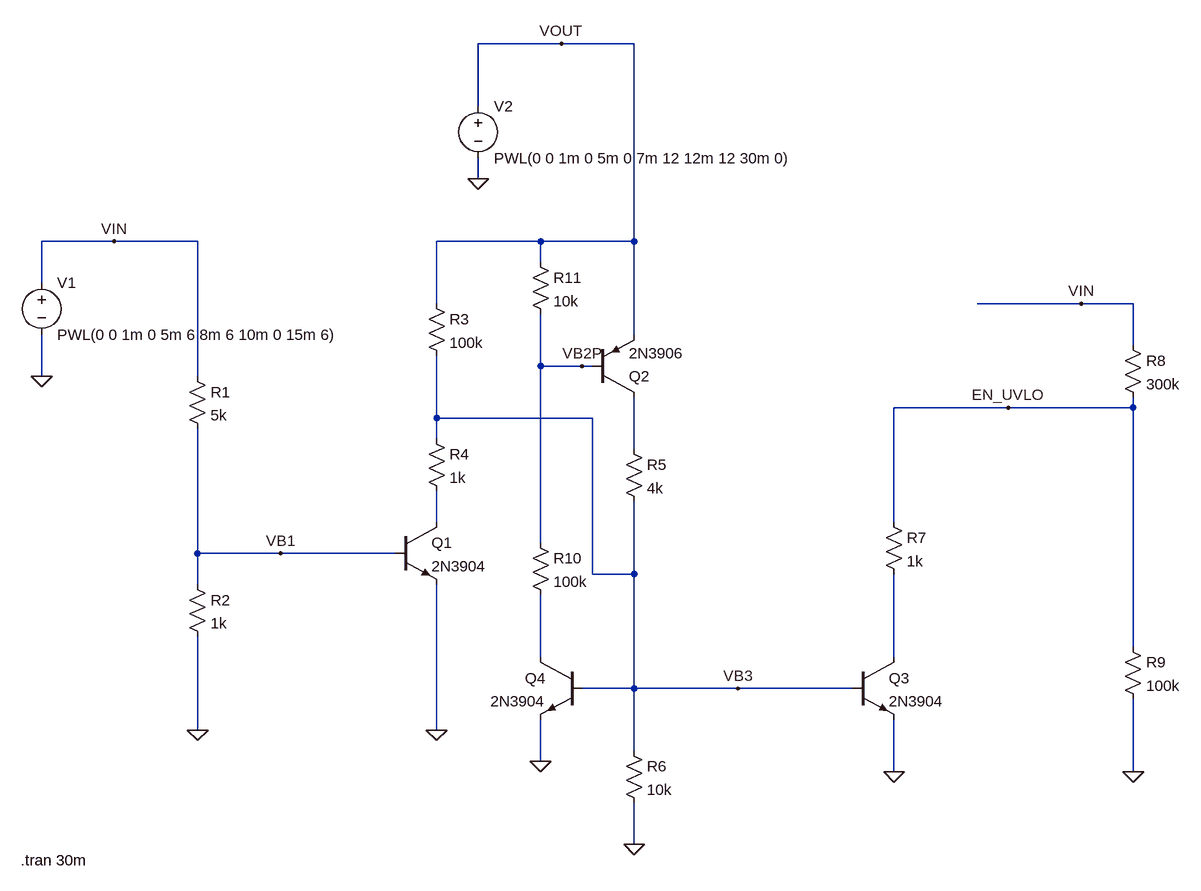
[diagram p0: schematic en_uvlo_lockout_old.asc]
en_uvlo_lockout_old.asc, the LTspice schematic file:
Version 4
SHEET 1 1280 680
WIRE 320 -720 192 -720
WIRE 432 -720 320 -720
WIRE 192 -624 192 -720
WIRE 192 -512 192 -544
WIRE -368 -416 -480 -416
WIRE -240 -416 -368 -416
WIRE 288 -416 128 -416
WIRE 432 -416 432 -720
WIRE 432 -416 288 -416
WIRE 288 -384 288 -416
WIRE -480 -352 -480 -416
WIRE 128 -320 128 -416
WIRE 1120 -320 960 -320
WIRE 1200 -320 1120 -320
WIRE 432 -272 432 -416
WIRE 1200 -256 1200 -320
WIRE 288 -224 288 -304
WIRE 352 -224 288 -224
WIRE 368 -224 352 -224
WIRE -480 -208 -480 -272
WIRE -240 -208 -240 -416
WIRE 1008 -160 832 -160
WIRE 1200 -160 1200 -176
WIRE 1200 -160 1008 -160
WIRE 128 -144 128 -240
WIRE 368 -144 128 -144
WIRE 128 -112 128 -144
WIRE 432 -96 432 -176
WIRE 128 16 128 -32
WIRE 832 16 832 -160
WIRE 288 48 288 -224
WIRE -240 64 -240 -128
WIRE -112 64 -240 64
WIRE 64 64 -112 64
WIRE 368 96 368 -144
WIRE 432 96 432 -16
WIRE 432 96 368 96
WIRE -240 112 -240 64
WIRE 1200 208 1200 -160
WIRE 288 224 288 128
WIRE 832 224 832 96
WIRE 432 272 432 96
WIRE 432 272 352 272
WIRE 592 272 432 272
WIRE 768 272 592 272
WIRE -240 336 -240 192
WIRE 128 336 128 112
WIRE 432 368 432 272
WIRE 288 384 288 320
WIRE 832 400 832 320
WIRE 1200 400 1200 288
WIRE 432 512 432 448
FLAG -240 336 0
FLAG 128 336 0
FLAG 432 512 0
FLAG 288 384 0
FLAG 832 400 0
FLAG 1200 400 0
FLAG -480 -208 0
FLAG 192 -512 0
FLAG -368 -416 VIN
FLAG 1120 -320 VIN
FLAG 1008 -160 EN_UVLO
FLAG -112 64 VB1
FLAG 592 272 VB3
FLAG 352 -224 VB2P
FLAG 320 -720 VOUT
SYMBOL npn 64 16 R0
SYMATTR InstName Q1
SYMATTR Value 2N3904
SYMBOL pnp 368 -176 M180
SYMATTR InstName Q2
SYMATTR Value 2N3906
SYMBOL npn 768 224 R0
SYMATTR InstName Q3
SYMATTR Value 2N3904
SYMBOL res -256 -224 R0
SYMATTR InstName R1
SYMATTR Value 5k
SYMBOL res -256 96 R0
SYMATTR InstName R2
SYMATTR Value 1k
SYMBOL res 112 -336 R0
SYMATTR InstName R3
SYMATTR Value 100k
SYMBOL res 112 -128 R0
SYMATTR InstName R4
SYMATTR Value 1k
SYMBOL res 416 -112 R0
SYMATTR InstName R5
SYMATTR Value 4k
SYMBOL res 416 352 R0
SYMATTR InstName R6
SYMATTR Value 10k
SYMBOL res 816 0 R0
SYMATTR InstName R7
SYMATTR Value 1k
SYMBOL res 1184 -272 R0
SYMATTR InstName R8
SYMATTR Value 300k
SYMBOL res 1184 192 R0
SYMATTR InstName R9
SYMATTR Value 100k
SYMBOL npn 352 224 M0
SYMATTR InstName Q4
SYMATTR Value 2N3904
SYMBOL res 272 32 R0
SYMATTR InstName R10
SYMATTR Value 100k
SYMBOL voltage -480 -368 R0
WINDOW 123 0 0 Left 0
WINDOW 39 0 0 Left 0
SYMATTR InstName V1
SYMATTR Value PWL(0 0 1m 0 5m 6 8m 6 10m 0 15m 6)
SYMBOL voltage 192 -640 R0
WINDOW 123 0 0 Left 0
WINDOW 39 0 0 Left 0
SYMATTR InstName V2
SYMATTR Value PWL(0 0 1m 0 5m 0 7m 12 12m 12 30m 0)
SYMBOL res 272 -400 R0
SYMATTR InstName R11
SYMATTR Value 10k
TEXT -512 536 Left 2 !.tran 30m

The netlist it stands for:
* en_uvlo_lockout_old.asc
Q1 N002 VB1 0 0 2N3904
Q2 N001 VB2P VOUT 0 2N3906
Q3 N004 VB3 0 0 2N3904
R1 VIN VB1 5k
R2 VB1 0 1k
R3 VOUT VB3 100k
R4 VB3 N002 1k
R5 N001 VB3 4k
R6 VB3 0 10k
R7 EN_UVLO N004 1k
R8 VIN EN_UVLO 300k
R9 EN_UVLO 0 100k
Q4 N003 VB3 0 0 2N3904
R10 VB2P N003 100k
V1 VIN 0 PWL(0 0 1m 0 5m 6 8m 6 10m 0 15m 6)
V2 VOUT 0 PWL(0 0 1m 0 5m 0 7m 12 12m 12 30m 0)
R11 VOUT VB2P 10k
.model NPN NPN
.model PNP PNP
.lib standard.bjt
.tran 30m
.backanno
.end